# EAGLE schematic omnibus (EAGLE 6.6.0)

## Sheet 1 of 3
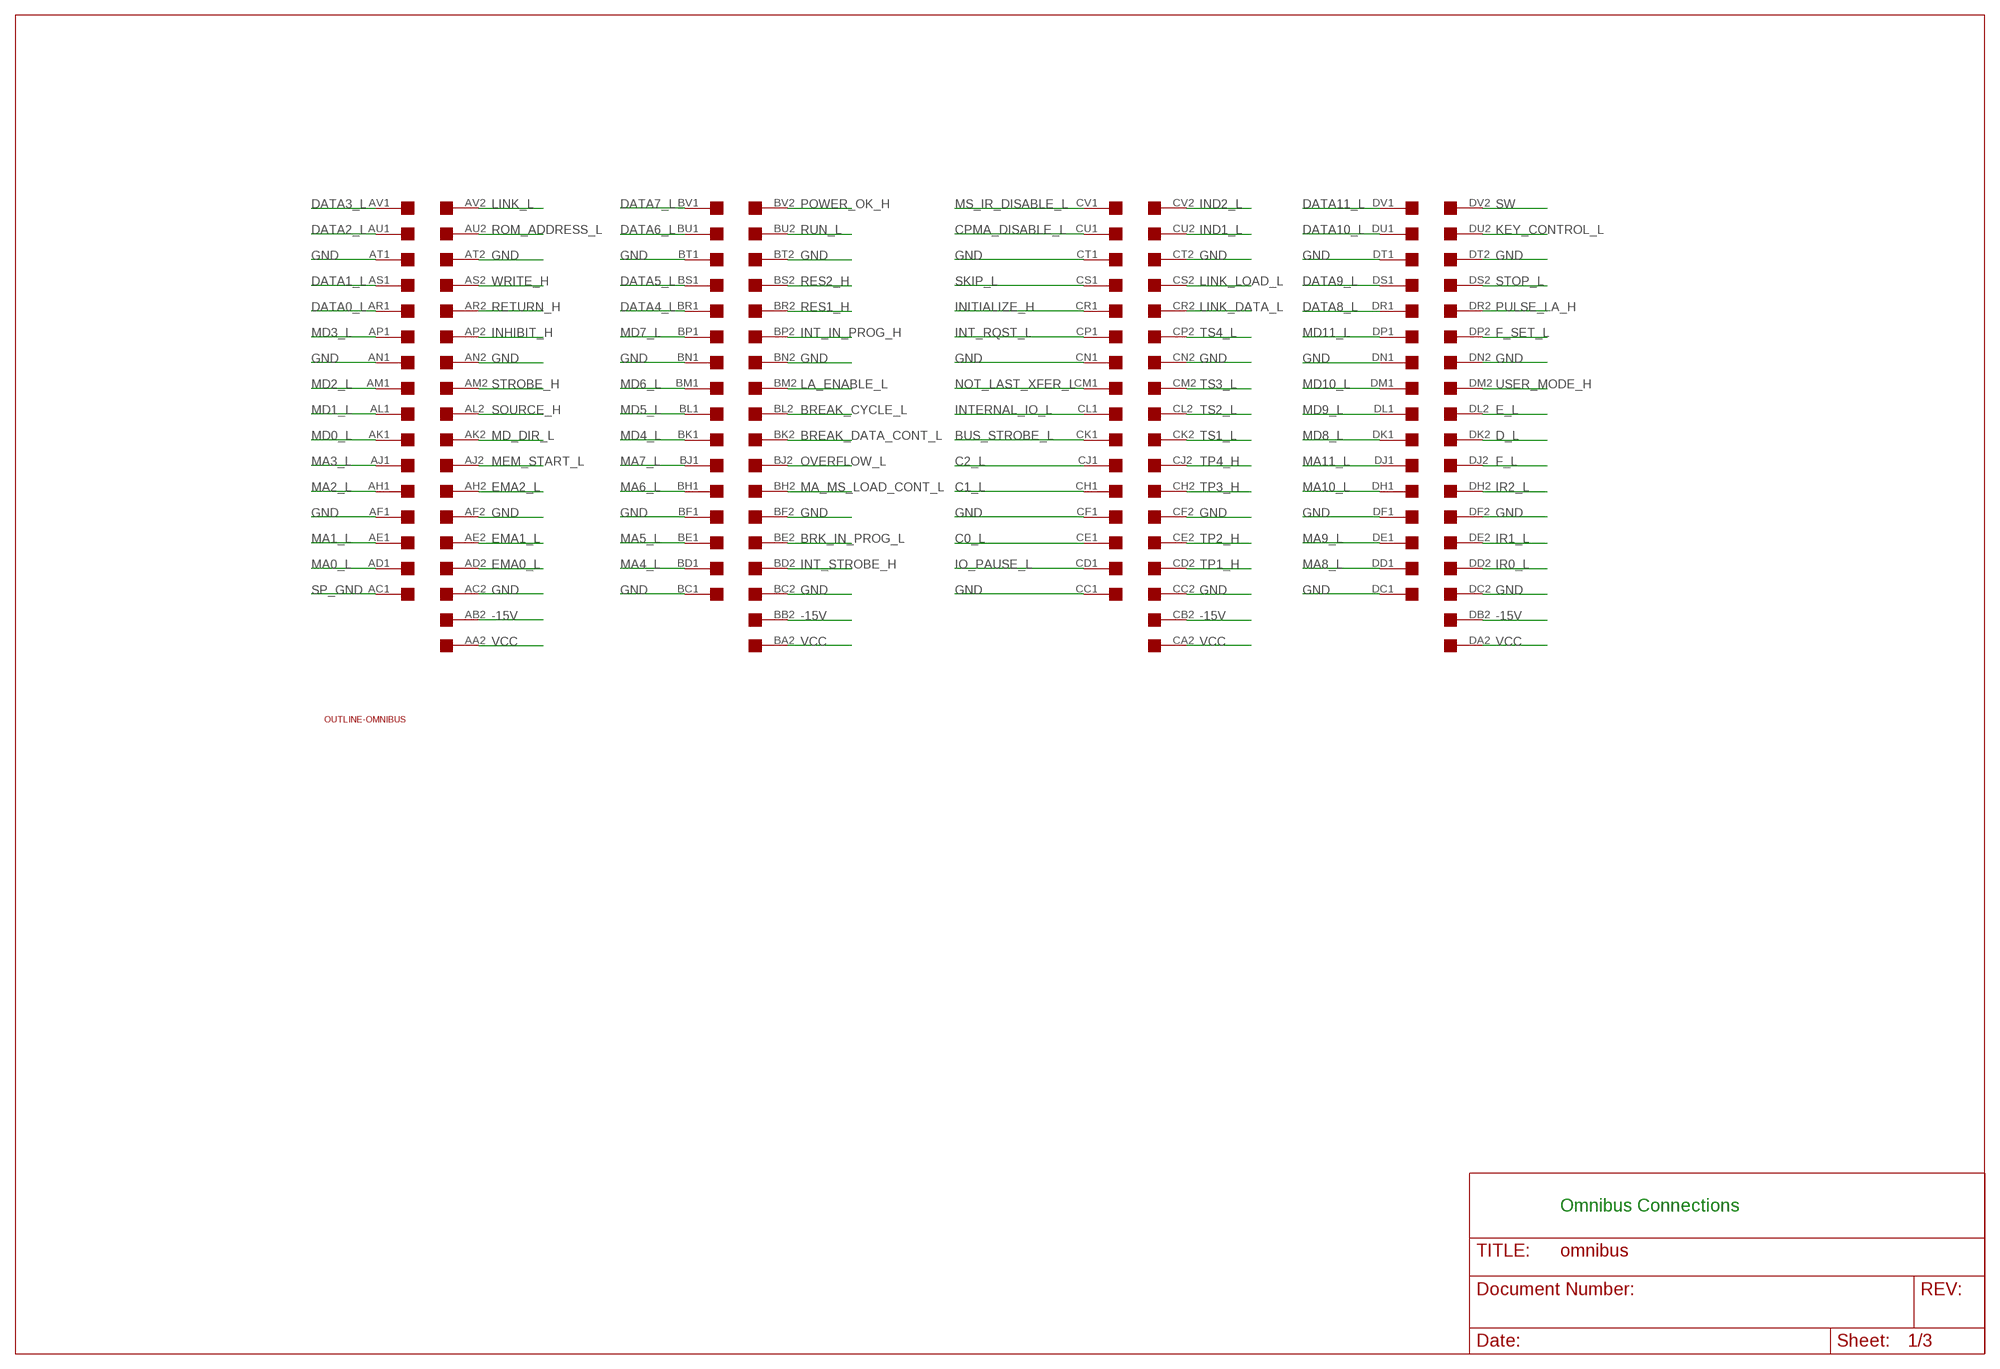
[diagram p0: schematic, sheet 1]

### Parts
U$1  OUTLINE-OMNIBUS  [OMNIBUS]
U$2  QUAD  [EDGE-CON8]

### Nets
-15V: U$2.AB2 U$2.BB2 U$2.CB2 U$2.DB2
BREAK_CYCLE_L: U$2.BL2
BREAK_DATA_CONT_L: U$2.BK2
BRK_IN_PROG_L: U$2.BE2
BUS_STROBE_L: U$2.CK1
C0_L: U$2.CE1 ; also sheet 2
C1_L: U$2.CH1 ; also sheet 2
C2_L: U$2.CJ1
CPMA_DISABLE_L: U$2.CU1
D_L: U$2.DK2
DATA0_L: U$2.AR1 ; also sheet 2
DATA1_L: U$2.AS1 ; also sheet 2
DATA2_L: U$2.AU1 ; also sheet 2
DATA3_L: U$2.AV1 ; also sheet 2
DATA4_L: U$2.BR1 ; also sheet 2
DATA5_L: U$2.BS1 ; also sheet 2
DATA6_L: U$2.BU1 ; also sheet 2
DATA7_L: U$2.BV1 ; also sheet 2
DATA8_L: U$2.DR1 ; also sheet 2
DATA9_L: U$2.DS1 ; also sheet 2
DATA10_L: U$2.DU1 ; also sheet 2
DATA11_L: U$2.DV1 ; also sheet 2
E_L: U$2.DL2
EMA0_L: U$2.AD2 ; also sheet 3
EMA1_L: U$2.AE2 ; also sheet 3
EMA2_L: U$2.AH2 ; also sheet 3
F_L: U$2.DJ2
F_SET_L: U$2.DP2
GND: U$2.AC2 U$2.AF1 U$2.AF2 U$2.AN1 U$2.AN2 U$2.AT1 U$2.AT2 U$2.BC1 U$2.BC2 U$2.BF1 U$2.BF2 U$2.BN1 U$2.BN2 U$2.BT1 U$2.BT2 U$2.CC1 U$2.CC2 U$2.CF1 U$2.CF2 U$2.CN1 U$2.CN2 U$2.CT1 U$2.CT2 U$2.DC1 U$2.DC2 U$2.DF1 U$2.DF2 U$2.DN1 U$2.DN2 U$2.DT1 U$2.DT2 ; also sheet 2,3
IND1_L: U$2.CU2
IND2_L: U$2.CV2
INHIBIT_H: U$2.AP2
INITIALIZE_H: U$2.CR1
INT_IN_PROG_H: U$2.BP2
INT_RQST_L: U$2.CP1 ; also sheet 2
INT_STROBE_H: U$2.BD2
INTERNAL_IO_L: U$2.CL1
IO_PAUSE_L: U$2.CD1 ; also sheet 2
IR0_L: U$2.DD2
IR1_L: U$2.DE2
IR2_L: U$2.DH2
KEY_CONTROL_L: U$2.DU2
LA_ENABLE_L: U$2.BM2
LINK_DATA_L: U$2.CR2
LINK_L: U$2.AV2
LINK_LOAD_L: U$2.CS2
MA0_L: U$2.AD1
MA1_L: U$2.AE1
MA2_L: U$2.AH1
MA3_L: U$2.AJ1
MA4_L: U$2.BD1
MA5_L: U$2.BE1
MA6_L: U$2.BH1
MA7_L: U$2.BJ1
MA8_L: U$2.DD1
MA9_L: U$2.DE1
MA10_L: U$2.DH1
MA11_L: U$2.DJ1
MA_MS_LOAD_CONT_L: U$2.BH2
MD0_L: U$2.AK1 ; also sheet 2
MD1_L: U$2.AL1 ; also sheet 2
MD2_L: U$2.AM1 ; also sheet 2
MD3_L: U$2.AP1 ; also sheet 2
MD4_L: U$2.BK1 ; also sheet 2
MD5_L: U$2.BL1 ; also sheet 2
MD6_L: U$2.BM1 ; also sheet 2
MD7_L: U$2.BP1 ; also sheet 2
MD8_L: U$2.DK1 ; also sheet 2
MD9_L: U$2.DL1 ; also sheet 2
MD10_L: U$2.DM1 ; also sheet 2
MD11_L: U$2.DP1 ; also sheet 2
MD_DIR_L: U$2.AK2
MEM_START_L: U$2.AJ2
MS_IR_DISABLE_L: U$2.CV1
NOT_LAST_XFER_L: U$2.CM1
OVERFLOW_L: U$2.BJ2
POWER_OK_H: U$2.BV2
PULSE_LA_H: U$2.DR2
RES1_H: U$2.BR2
RES2_H: U$2.BS2
RETURN_H: U$2.AR2
ROM_ADDRESS_L: U$2.AU2
RUN_L: U$2.BU2
SKIP_L: U$2.CS1 ; also sheet 2
SOURCE_H: U$2.AL2
SP_GND: U$2.AC1
STOP_L: U$2.DS2
STROBE_H: U$2.AM2
SW: U$2.DV2
TP1_H: U$2.CD2
TP2_H: U$2.CE2
TP3_H: U$2.CH2 ; also sheet 2
TP4_H: U$2.CJ2
TS1_L: U$2.CK2
TS2_L: U$2.CL2
TS3_L: U$2.CM2
TS4_L: U$2.CP2
USER_MODE_H: U$2.DM2
VCC: U$2.AA2 U$2.BA2 U$2.CA2 U$2.DA2 ; also sheet 2,3
WRITE_H: U$2.AS2
Unconnected: U$2.AA1 U$2.AB1 U$2.BA1 U$2.BB1 U$2.CA1 U$2.CB1 U$2.DA1 U$2.DB1

### Notes on the sheet
- Omnibus Connections

## Sheet 2 of 3
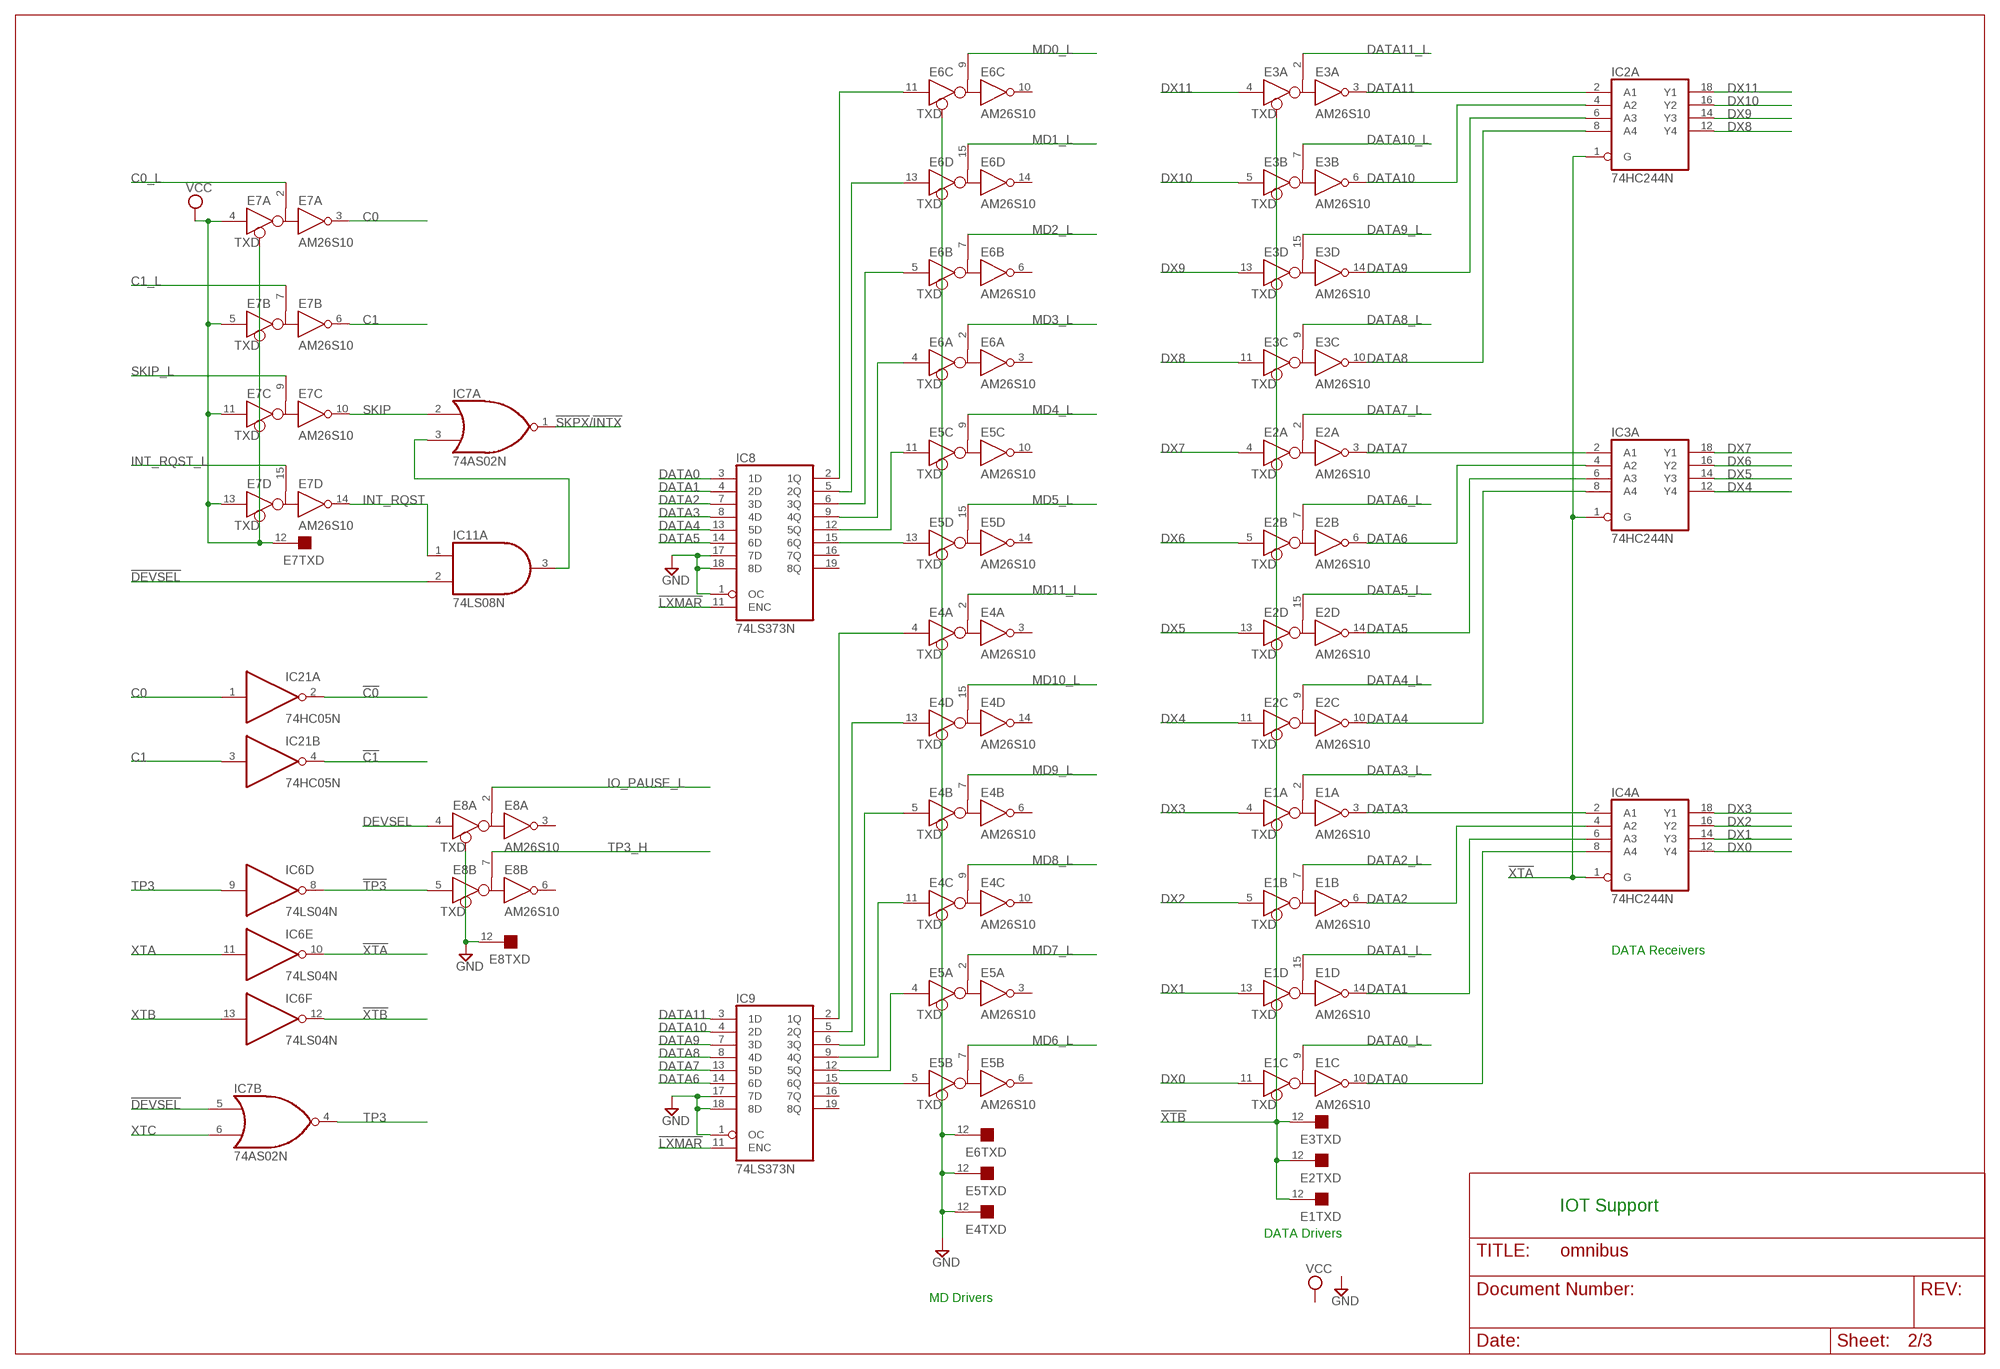
[diagram p1: schematic, sheet 2]

### Parts
E1  AM26S10  [DIL16]
E2  AM26S10  [DIL16]
E3  AM26S10  [DIL16]
E4  AM26S10  [DIL16]
E5  AM26S10  [DIL16]
E6  AM26S10  [DIL16]
E7  AM26S10  [DIL16]
E8  AM26S10  [DIL16]
IC2  74HC244N  74LS244N  [DIL20]
IC3  74HC244N  74LS244N  [DIL20]
IC4  74HC244N  74LS244N  [DIL20]
IC6  74LS04N  [DIL14]
IC7  74AS02N  [DIL14]
IC8  74LS373N  [DIL20]
IC9  74LS373N  [DIL20]
IC11  74LS08N  [DIL14]
IC21  74HC05N  74ALS05N  [DIL14]

### Nets
!C0: IC21.2(A:O) ; also sheet 3
!C1: IC21.4(B:O) ; also sheet 3
!DEVSEL: IC7.5(B:I0) IC11.2(A:I1) ; also sheet 3
!LXMAR: IC8.11(ENC) IC9.11(ENC)
!SKPX!/!INTX: IC7.1(A:O) ; also sheet 3
!TP3: E8.5(B:D) IC6.8(D:O)
!XTA: IC2.1(A:G) IC3.1(A:G) IC4.1(A:G) IC6.10(E:O)
!XTB: E1.12(TXD:TXD) E2.12(TXD:TXD) E3.12(TXD:TXD) IC6.12(F:O)
C0: E7.3(A:R) IC21.1(A:I)
C0_L: E7.2(A:B) ; also sheet 1
C1: E7.6(B:R) IC21.3(B:I)
C1_L: E7.7(B:B) ; also sheet 1
DATA0: E1.10(C:R) IC4.8(A:A4) IC8.3(1D)
DATA0_L: E1.9(C:B) ; also sheet 1
DATA1: E1.14(D:R) IC4.6(A:A3) IC8.4(2D)
DATA1_L: E1.15(D:B) ; also sheet 1
DATA2: E1.6(B:R) IC4.4(A:A2) IC8.7(3D)
DATA2_L: E1.7(B:B) ; also sheet 1
DATA3: E1.3(A:R) IC4.2(A:A1) IC8.8(4D)
DATA3_L: E1.2(A:B) ; also sheet 1
DATA4: E2.10(C:R) IC3.8(A:A4) IC8.13(5D)
DATA4_L: E2.9(C:B) ; also sheet 1
DATA5: E2.14(D:R) IC3.6(A:A3) IC8.14(6D)
DATA5_L: E2.15(D:B) ; also sheet 1
DATA6: E2.6(B:R) IC3.4(A:A2) IC9.14(6D)
DATA6_L: E2.7(B:B) ; also sheet 1
DATA7: E2.3(A:R) IC3.2(A:A1) IC9.13(5D)
DATA7_L: E2.2(A:B) ; also sheet 1
DATA8: E3.10(C:R) IC2.8(A:A4) IC9.8(4D)
DATA8_L: E3.9(C:B) ; also sheet 1
DATA9: E3.14(D:R) IC2.6(A:A3) IC9.7(3D)
DATA9_L: E3.15(D:B) ; also sheet 1
DATA10: E3.6(B:R) IC2.4(A:A2) IC9.4(2D)
DATA10_L: E3.7(B:B) ; also sheet 1
DATA11: E3.3(A:R) IC2.2(A:A1) IC9.3(1D)
DATA11_L: E3.2(A:B) ; also sheet 1
DEVSEL: E8.4(A:D) ; also sheet 3
DX0: E1.11(C:D) IC4.12(A:Y4) ; also sheet 3
DX1: E1.13(D:D) IC4.14(A:Y3) ; also sheet 3
DX2: E1.5(B:D) IC4.16(A:Y2) ; also sheet 3
DX3: E1.4(A:D) IC4.18(A:Y1) ; also sheet 3
DX4: E2.11(C:D) IC3.12(A:Y4) ; also sheet 3
DX5: E2.13(D:D) IC3.14(A:Y3) ; also sheet 3
DX6: E2.5(B:D) IC3.16(A:Y2) ; also sheet 3
DX7: E2.4(A:D) IC3.18(A:Y1) ; also sheet 3
DX8: E3.11(C:D) IC2.12(A:Y4) ; also sheet 3
DX9: E3.13(D:D) IC2.14(A:Y3) ; also sheet 3
DX10: E3.5(B:D) IC2.16(A:Y2) ; also sheet 3
DX11: E3.4(A:D) IC2.18(A:Y1) ; also sheet 3
GND: E4.12(TXD:TXD) E5.12(TXD:TXD) E6.12(TXD:TXD) E8.12(TXD:TXD) IC8.1(OC) IC8.17(7D) IC8.18(8D) IC9.1(OC) IC9.17(7D) IC9.18(8D) ; also sheet 1,3
INT_RQST: E7.14(D:R) IC11.1(A:I0)
INT_RQST_L: E7.15(D:B) ; also sheet 1
IO_PAUSE_L: E8.2(A:B) ; also sheet 1
MD0_L: E6.9(C:B) ; also sheet 1
MD1_L: E6.15(D:B) ; also sheet 1
MD2_L: E6.7(B:B) ; also sheet 1
MD3_L: E6.2(A:B) ; also sheet 1
MD4_L: E5.9(C:B) ; also sheet 1
MD5_L: E5.15(D:B) ; also sheet 1
MD6_L: E5.7(B:B) ; also sheet 1
MD7_L: E5.2(A:B) ; also sheet 1
MD8_L: E4.9(C:B) ; also sheet 1
MD9_L: E4.7(B:B) ; also sheet 1
MD10_L: E4.15(D:B) ; also sheet 1
MD11_L: E4.2(A:B) ; also sheet 1
N$2: IC7.3(A:I1) IC11.3(A:O)
N$3: E6.11(C:D) IC8.2(1Q)
N$4: E6.13(D:D) IC8.5(2Q)
N$5: E6.5(B:D) IC8.6(3Q)
N$6: E6.4(A:D) IC8.9(4Q)
N$7: E5.11(C:D) IC8.12(5Q)
N$8: E5.13(D:D) IC8.15(6Q)
N$9: E5.5(B:D) IC9.15(6Q)
N$10: E5.4(A:D) IC9.12(5Q)
N$11: E4.11(C:D) IC9.9(4Q)
N$12: E4.5(B:D) IC9.6(3Q)
N$14: E4.13(D:D) IC9.5(2Q)
N$15: E4.4(A:D) IC9.2(1Q)
SKIP: E7.10(C:R) IC7.2(A:I0)
SKIP_L: E7.9(C:B) ; also sheet 1
TP3: IC6.9(D:I) IC7.4(B:O)
TP3_H: E8.7(B:B) ; also sheet 1
VCC: E7.4(A:D) E7.5(B:D) E7.11(C:D) E7.12(TXD:TXD) E7.13(D:D) ; also sheet 1,3
XTA: IC6.11(E:I) ; also sheet 3
XTB: IC6.13(F:I) ; also sheet 3
XTC: IC7.6(B:I1) ; also sheet 3
Unconnected: E4.3(A:R) E4.6(B:R) E4.10(C:R) E4.14(D:R) E5.3(A:R) E5.6(B:R) E5.10(C:R) E5.14(D:R) E6.3(A:R) E6.6(B:R) E6.10(C:R) E6.14(D:R) E8.3(A:R) E8.6(B:R) E8.9(C:B) E8.10(C:R) E8.11(C:D) E8.13(D:D) E8.14(D:R) E8.15(D:B) IC2.3(B:Y4) IC2.5(B:Y3) IC2.7(B:Y2) IC2.9(B:Y1) IC2.11(B:A1) IC2.13(B:A2) IC2.15(B:A3) IC2.17(B:A4) IC2.19(B:G) IC3.3(B:Y4) IC3.5(B:Y3) IC3.7(B:Y2) IC3.9(B:Y1) IC3.11(B:A1) IC3.13(B:A2) IC3.15(B:A3) IC3.17(B:A4) IC3.19(B:G) IC4.3(B:Y4) IC4.5(B:Y3) IC4.7(B:Y2) IC4.9(B:Y1) IC4.11(B:A1) IC4.13(B:A2) IC4.15(B:A3) IC4.17(B:A4) IC4.19(B:G) IC6.3(B:I) IC6.4(B:O) IC6.5(C:I) IC6.6(C:O) IC8.16(7Q) IC8.19(8Q) IC9.16(7Q) IC9.19(8Q) IC21.8(D:O) IC21.9(D:I) IC21.10(E:O) IC21.11(E:I) IC21.12(F:O) IC21.13(F:I)

### Notes on the sheet
- DATA Receivers
- IOT Support
- DATA Drivers
- MD Drivers

## Sheet 3 of 3
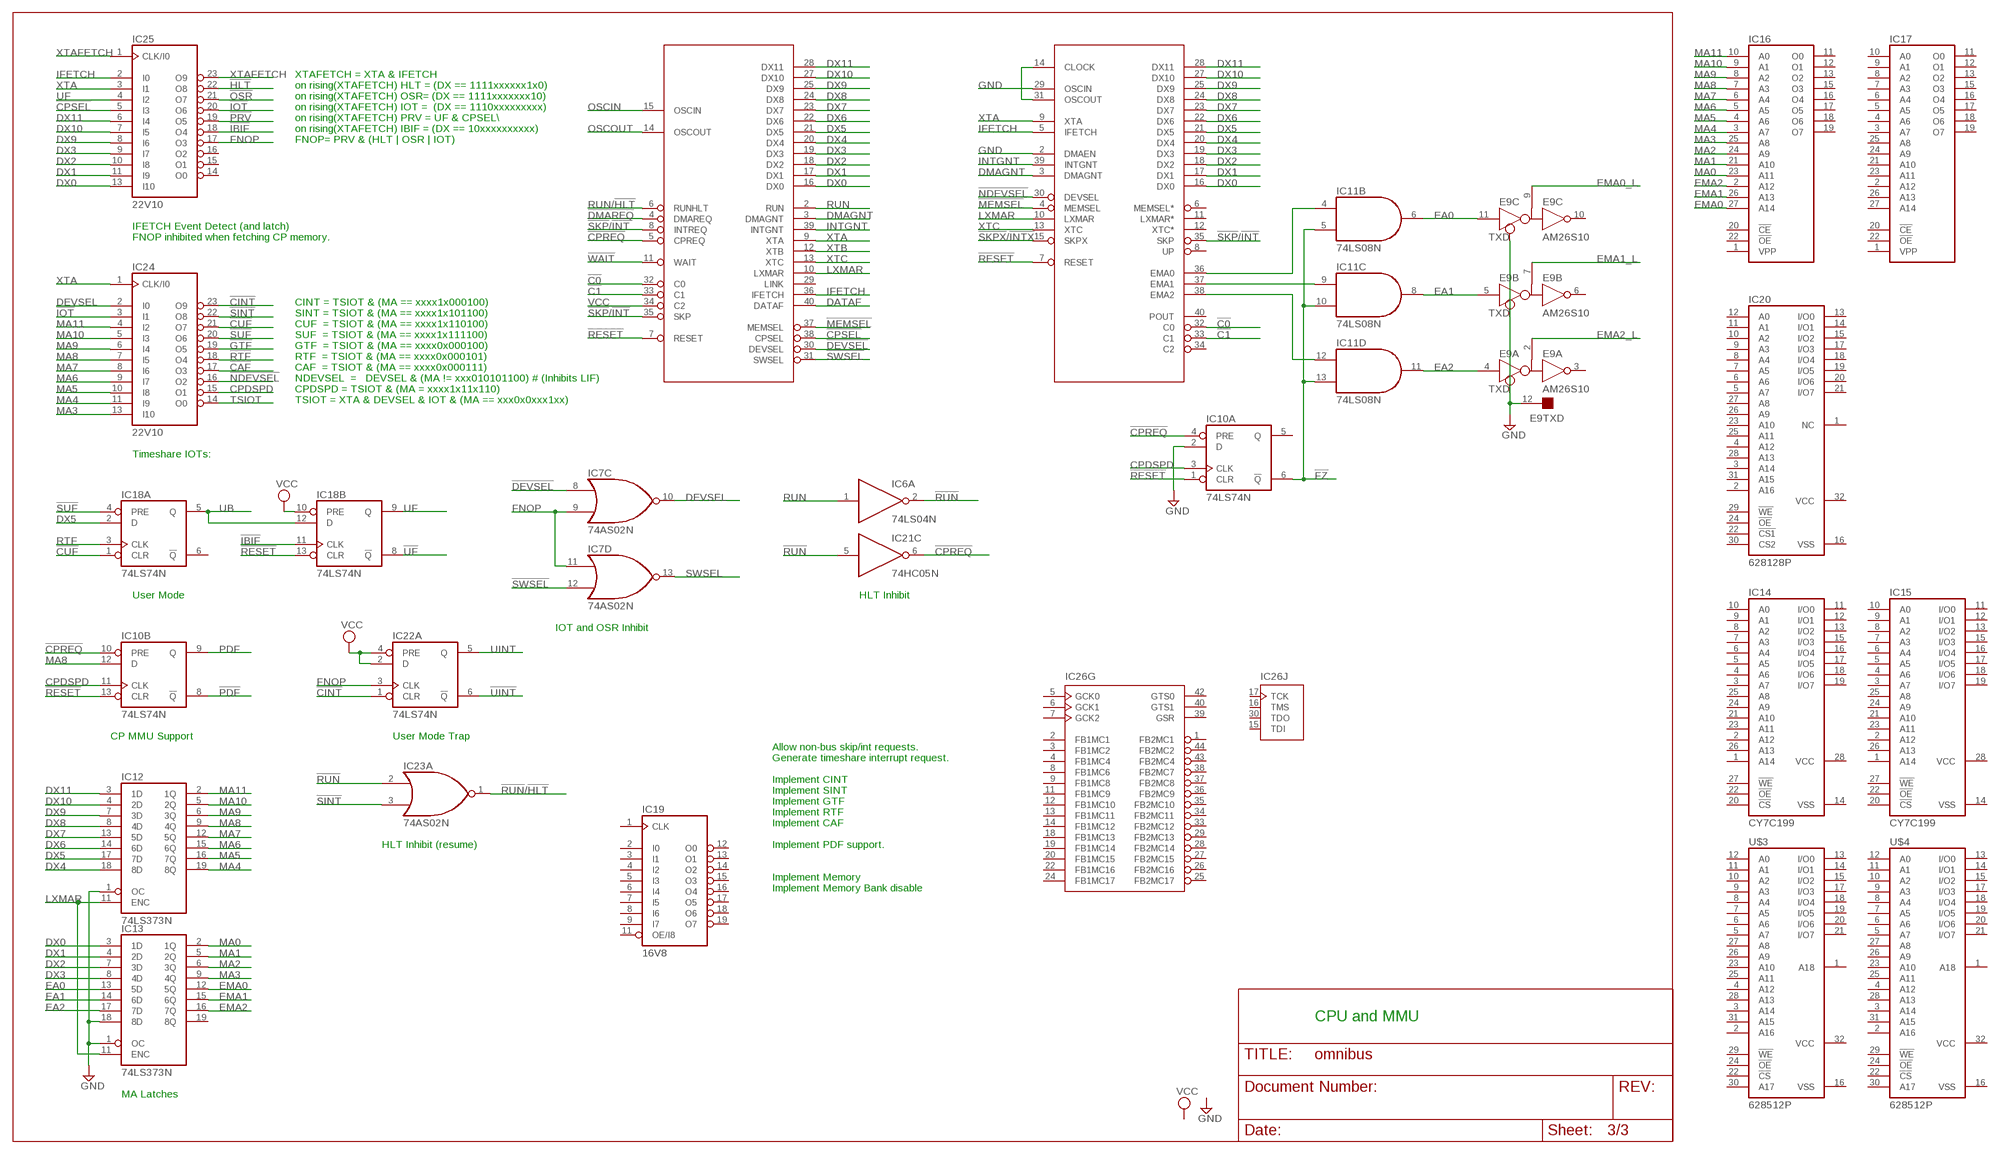
[diagram p2: schematic, sheet 3]

### Parts
E9  AM26S10  [DIL16]
IC1  IM6100  [DIL40]
IC5  IM6102  [DIL40]
IC10  74LS74N  [DIL14]
IC12  74LS373N  [DIL20]
IC13  74LS373N  [DIL20]
IC14  CY7C199  62832P  [DIL28-3]
IC15  CY7C199  62832P  [DIL28-3]
IC16  27256  [DIL28]
IC17  27256  [DIL28]
IC18  74LS74N  [DIL14]
IC19  16V8  [DIL20]
IC20  628128P  [DIL32]
IC22  74LS74N  [DIL14]
IC23  74AS02N  [DIL14]
IC24  22V10  [DIL24-3]
IC25  22V10  [DIL24-3]
IC26  XC9536-44  [PLCC-S44]
U$3  628512P  [DIL32]
U$4  628512P  [DIL32]

### Nets
!C0: IC1.32(C0) IC5.32(C0) ; also sheet 2
!C1: IC1.33(C1) IC5.33(C1) ; also sheet 2
!CAF: IC24.17(O3)
!CINT: IC22.1(A:CLR) IC24.23(O9)
!CPREQ: IC1.5(CPREQ) IC10.4(A:PRE) IC10.10(B:PRE) IC21.6(C:O)
!CPSEL: IC1.38(CPSEL) IC25.5(I3)
!CUF: IC18.1(A:CLR) IC24.21(O7)
!DEVSEL: IC1.30(DEVSEL) IC7.8(C:I0) ; also sheet 2
!DMAREQ: IC1.4(DMAREQ)
!FZ: IC10.6(A:!Q) IC11.5(B:I1) IC11.10(C:I1) IC11.13(D:I1)
!GTF: IC24.19(O5)
!HLT: IC25.22(O8)
!IBIF: IC18.11(B:CLK) IC25.18(O4)
!IOT: IC24.3(I1) IC25.20(O6)
!MEMSEL: IC1.37(MEMSEL) IC5.4(MEMSEL)
!NDEVSEL: IC5.30(DEVSEL) IC24.16(O2)
!OSR: IC25.21(O7)
!PDF: IC10.8(B:!Q)
!PRV: IC25.19(O5)
!RESET: IC1.7(RESET) IC5.7(RESET) IC10.1(A:CLR) IC10.13(B:CLR) IC18.13(B:CLR)
!RTF: IC24.18(O4)
!RUN: IC6.2(A:O) IC21.5(C:I) IC23.2(A:I0)
!RUN!/!HLT: IC23.1(A:O)
!SINT: IC23.3(A:I1) IC24.22(O8)
!SKP!/!INT: IC1.8(INTREQ) IC1.35(SKP) IC5.35(SKP)
!SKPX!/!INTX: IC5.15(SKPX) ; also sheet 2
!SUF: IC18.4(A:PRE) IC24.20(O6)
!SWSEL: IC1.31(SWSEL) IC7.12(D:I1)
!UF: IC18.8(B:!Q)
!UINT: IC22.6(A:!Q)
!WAIT: IC1.11(WAIT)
CPDSPD: IC10.3(A:CLK) IC10.11(B:CLK) IC24.15(O1)
DATAF: IC1.40(DATAF)
DEVSEL: IC7.10(C:O) IC24.2(I0) ; also sheet 2
DMAGNT: IC1.3(DMAGNT) IC5.3(DMAGNT)
DX0: IC1.16(DX0) IC5.16(DX0) IC13.3(1D) IC25.13(I10) ; also sheet 2
DX1: IC1.17(DX1) IC5.17(DX1) IC13.4(2D) IC25.11(I9) ; also sheet 2
DX2: IC1.18(DX2) IC5.18(DX2) IC13.7(3D) IC25.10(I8) ; also sheet 2
DX3: IC1.19(DX3) IC5.19(DX3) IC13.8(4D) IC25.9(I7) ; also sheet 2
DX4: IC1.20(DX4) IC5.20(DX4) IC12.18(8D) ; also sheet 2
DX5: IC1.21(DX5) IC5.21(DX5) IC12.17(7D) IC18.2(A:D) ; also sheet 2
DX6: IC1.22(DX6) IC5.22(DX6) IC12.14(6D) ; also sheet 2
DX7: IC1.23(DX7) IC5.23(DX7) IC12.13(5D) ; also sheet 2
DX8: IC1.24(DX8) IC5.24(DX8) IC12.8(4D) ; also sheet 2
DX9: IC1.25(DX9) IC5.25(DX9) IC12.7(3D) IC25.8(I6) ; also sheet 2
DX10: IC1.27(DX10) IC5.27(DX10) IC12.4(2D) IC25.7(I5) ; also sheet 2
DX11: IC1.28(DX11) IC5.28(DX11) IC12.3(1D) IC25.6(I4) ; also sheet 2
EA0: E9.11(C:D) IC11.6(B:O) IC13.13(5D)
EA1: E9.5(B:D) IC11.8(C:O) IC13.14(6D)
EA2: E9.4(A:D) IC11.11(D:O) IC13.17(7D)
EMA0: IC13.12(5Q) IC16.27(A14)
EMA0_L: E9.9(C:B) ; also sheet 1
EMA1: IC13.15(6Q) IC16.26(A13)
EMA1_L: E9.7(B:B) ; also sheet 1
EMA2: IC13.16(7Q) IC16.2(A12)
EMA2_L: E9.2(A:B) ; also sheet 1
FNOP: IC7.9(C:I1) IC7.11(D:I0) IC22.3(A:CLK) IC25.17(O3)
GND: E9.12(TXD:TXD) IC5.2(DMAEN) IC5.29(OSCIN) IC10.2(A:D) IC12.1(OC) IC13.1(OC) IC13.18(8D) ; also sheet 1,2
IFETCH: IC1.36(IFETCH) IC5.5(IFETCH) IC25.2(I0)
INTGNT: IC1.39(INTGNT) IC5.39(INTGNT)
LXMAR: IC1.10(LXMAR) IC5.10(LXMAR) IC12.11(ENC) IC13.11(ENC)
MA0: IC13.2(1Q) IC16.23(A11)
MA1: IC13.5(2Q) IC16.21(A10)
MA2: IC13.6(3Q) IC16.24(A9)
MA3: IC13.9(4Q) IC16.25(A8) IC24.13(I10)
MA4: IC12.19(8Q) IC16.3(A7) IC24.11(I9)
MA5: IC12.16(7Q) IC16.4(A6) IC24.10(I8)
MA6: IC12.15(6Q) IC16.5(A5) IC24.9(I7)
MA7: IC12.12(5Q) IC16.6(A4) IC24.8(I6)
MA8: IC10.12(B:D) IC12.9(4Q) IC16.7(A3) IC24.7(I5)
MA9: IC12.6(3Q) IC16.8(A2) IC24.6(I4)
MA10: IC12.5(2Q) IC16.9(A1) IC24.5(I3)
MA11: IC12.2(1Q) IC16.10(A0) IC24.4(I2)
N$1: IC5.14(CLOCK) IC5.31(OSCOUT)
N$16: IC5.37(EMA1) IC11.9(C:I0)
N$17: IC5.36(EMA0) IC11.4(B:I0)
N$18: IC5.38(EMA2) IC11.12(D:I0)
OSCIN: IC1.15(OSCIN)
OSCOUT: IC1.14(OSCOUT)
PDF: IC10.9(B:Q)
RTF: IC18.3(A:CLK)
RUN: IC1.2(RUN) IC6.1(A:I)
RUN/!HLT: IC1.6(RUNHLT)
SWSEL: IC7.13(D:O)
TSIOT: IC24.14(O0)
UB: IC18.5(A:Q) IC18.12(B:D)
UF: IC18.9(B:Q) IC25.4(I2)
UINT: IC22.5(A:Q)
VCC: IC1.34(C2) IC18.10(B:PRE) IC22.2(A:D) IC22.4(A:PRE) ; also sheet 1,2
XTA: IC1.9(XTA) IC5.9(XTA) IC24.1(CLK/I0) IC25.3(I1) ; also sheet 2
XTAFETCH: IC25.1(CLK/I0) IC25.23(O9)
XTB: IC1.12(XTB) ; also sheet 2
XTC: IC1.13(XTC) IC5.13(XTC) ; also sheet 2
Unconnected: E9.3(A:R) E9.6(B:R) E9.10(C:R) E9.13(D:D) E9.14(D:R) E9.15(D:B) IC1.29(LINK) IC5.6(MEMSEL*) IC5.8(UP) IC5.11(LXMAR*) IC5.12(XTC*) IC5.34(C2) IC5.40(POUT) IC10.5(A:Q) IC13.19(8Q) IC14.1(A14) IC14.2(A12) IC14.3(A7) IC14.4(A6) IC14.5(A5) IC14.6(A4) IC14.7(A3) IC14.8(A2) IC14.9(A1) IC14.10(A0) IC14.11(I/O0) IC14.12(I/O1) IC14.13(I/O2) IC14.15(I/O3) IC14.16(I/O4) IC14.17(I/O5) IC14.18(I/O6) IC14.19(I/O7) IC14.20(!CS) IC14.21(A10) IC14.22(!OE) IC14.23(A11) IC14.24(A9) IC14.25(A8) IC14.26(A13) IC14.27(!WE) IC15.1(A14) IC15.2(A12) IC15.3(A7) IC15.4(A6) IC15.5(A5) IC15.6(A4) IC15.7(A3) IC15.8(A2) IC15.9(A1) IC15.10(A0) IC15.11(I/O0) IC15.12(I/O1) IC15.13(I/O2) IC15.15(I/O3) IC15.16(I/O4) IC15.17(I/O5) IC15.18(I/O6) IC15.19(I/O7) IC15.20(!CS) IC15.21(A10) IC15.22(!OE) IC15.23(A11) IC15.24(A9) IC15.25(A8) IC15.26(A13) IC15.27(!WE) IC16.1(VPP) IC16.11(O0) IC16.12(O1) IC16.13(O2) IC16.15(O3) IC16.16(O4) IC16.17(O5) IC16.18(O6) IC16.19(O7) IC16.20(!CE) IC16.22(!OE) IC17.1(VPP) IC17.2(A12) IC17.3(A7) IC17.4(A6) IC17.5(A5) IC17.6(A4) IC17.7(A3) IC17.8(A2) IC17.9(A1) IC17.10(A0) IC17.11(O0) IC17.12(O1) IC17.13(O2) IC17.15(O3) IC17.16(O4) IC17.17(O5) IC17.18(O6) IC17.19(O7) IC17.20(!CE) IC17.21(A10) IC17.22(!OE) IC17.23(A11) IC17.24(A9) IC17.25(A8) IC17.26(A13) IC17.27(A14) IC18.6(A:!Q) IC19.1(CLK) IC19.2(I0) IC19.3(I1) IC19.4(I2) IC19.5(I3) IC19.6(I4) IC19.7(I5) IC19.8(I6) IC19.9(I7) IC19.11(OE/I8) IC19.12(O0) IC19.13(O1) IC19.14(O2) IC19.15(O3) IC19.16(O4) IC19.17(O5) IC19.18(O6) IC19.19(O7) IC20.1(NC) IC20.2(A16) IC20.3(A14) IC20.4(A12) IC20.5(A7) IC20.6(A6) IC20.7(A5) IC20.8(A4) IC20.9(A3) IC20.10(A2) IC20.11(A1) IC20.12(A0) IC20.13(I/O0) IC20.14(I/O1) IC20.15(I/O2) IC20.17(I/O3) IC20.18(I/O4) IC20.19(I/O5) IC20.20(I/O6) IC20.21(I/O7) IC20.22(!CS1) IC20.23(A10) IC20.24(!OE) IC20.25(A11) IC20.26(A9) IC20.27(A8) IC20.28(A13) IC20.29(!WE) IC20.30(CS2) IC20.31(A15) IC22.8(B:!Q) IC22.9(B:Q) IC22.10(B:PRE) IC22.11(B:CLK) IC22.12(B:D) IC22.13(B:CLR) IC23.4(B:O) IC23.5(B:I0) IC23.6(B:I1) IC23.8(C:I0) IC23.9(C:I1) IC23.10(C:O) IC23.11(D:I0) IC23.12(D:I1) IC23.13(D:O) IC25.14(O0) IC25.15(O1) IC25.16(O2) IC26.1(G:FB2MC1) IC26.2(G:FB1MC1) IC26.3(G:FB1MC2) IC26.4(G:FB1MC4) IC26.5(G:GCK0) IC26.6(G:GCK1) IC26.7(G:GCK2) IC26.8(G:FB1MC6) IC26.9(G:FB1MC8) IC26.11(G:FB1MC9) IC26.12(G:FB1MC10) IC26.13(G:FB1MC11) IC26.14(G:FB1MC12) IC26.15(J:TDI) IC26.16(J:TMS) IC26.17(J:TCK) IC26.18(G:FB1MC13) IC26.19(G:FB1MC14) IC26.20(G:FB1MC15) IC26.22(G:FB1MC16) IC26.24(G:FB1MC17) IC26.25(G:FB2MC17) IC26.26(G:FB2MC16) IC26.27(G:FB2MC15) IC26.28(G:FB2MC14) IC26.29(G:FB2MC13) IC26.30(J:TDO) IC26.33(G:FB2MC12) IC26.34(G:FB2MC11) IC26.35(G:FB2MC10) IC26.36(G:FB2MC9) IC26.37(G:FB2MC8) IC26.38(G:FB2MC7) IC26.39(G:GSR) IC26.40(G:GTS1) IC26.42(G:GTS0) IC26.43(G:FB2MC4) IC26.44(G:FB2MC2) U$3.1(A18) U$3.2(A16) U$3.3(A14) U$3.4(A12) U$3.5(A7) U$3.6(A6) U$3.7(A5) U$3.8(A4) U$3.9(A3) U$3.10(A2) U$3.11(A1) U$3.12(A0) U$3.13(I/O0) U$3.14(I/O1) U$3.15(I/O2) U$3.17(I/O3) U$3.18(I/O4) U$3.19(I/O5) U$3.20(I/O6) U$3.21(I/O7) U$3.22(!CS) U$3.23(A10) U$3.24(!OE) U$3.25(A11) U$3.26(A9) U$3.27(A8) U$3.28(A13) U$3.29(!WE) U$3.30(A17) U$3.31(A15) U$4.1(A18) U$4.2(A16) U$4.3(A14) U$4.4(A12) U$4.5(A7) U$4.6(A6) U$4.7(A5) U$4.8(A4) U$4.9(A3) U$4.10(A2) U$4.11(A1) U$4.12(A0) U$4.13(I/O0) U$4.14(I/O1) U$4.15(I/O2) U$4.17(I/O3) U$4.18(I/O4) U$4.19(I/O5) U$4.20(I/O6) U$4.21(I/O7) U$4.22(!CS) U$4.23(A10) U$4.24(!OE) U$4.25(A11) U$4.26(A9) U$4.27(A8) U$4.28(A13) U$4.29(!WE) U$4.30(A17) U$4.31(A15)

### Notes on the sheet
- XTAFETCH = XTA & IFETCH
- on rising(XTAFETCH) HLT = (DX == 1111xxxxxx1x0)
- on rising(XTAFETCH) OSR= (DX == 1111xxxxxxx10)
- on rising(XTAFETCH) IOT =  (DX == 1110xxxxxxxxx)
- on rising(XTAFETCH) PRV = UF & CPSEL\\
- on rising(XTAFETCH) IBIF = (DX == 10xxxxxxxxxx)
- FNOP= PRV & (HLT | OSR | IOT)
- IFETCH Event Detect (and latch)
- FNOP inhibited when fetching CP memory.
- CINT = TSIOT & (MA == xxxx1x000100)
- SINT = TSIOT & (MA == xxxx1x101100)
- CUF  = TSIOT & (MA == xxxx1x110100)
- SUF  = TSIOT & (MA == xxxx1x111100)
- GTF  = TSIOT & (MA == xxxx0x000100)
- RTF  = TSIOT & (MA == xxxx0x000101)
- CAF  = TSIOT & (MA == xxxx0x000111)
- NDEVSEL  =   DEVSEL & (MA \!= xxx010101100) # (Inhibits LIF)
- CPDSPD = TSIOT & (MA = xxxx1x11x110)
- TSIOT = XTA & DEVSEL & IOT & (MA == xxx0x0xxx1xx)
- Timeshare IOTs:
- User Mode | HLT Inhibit
- IOT and OSR Inhibit
- CP MMU Support | User Mode Trap
- Allow non-bus skip/int requests.
- Generate timeshare interrupt request.
- Implement CINT
- Implement SINT
- Implement GTF
- Implement RTF
- Implement CAF
- HLT Inhibit (resume) | Implement PDF support.
- Implement Memory
- Implement Memory Bank disable
- CPU and MMU
- MA Latches

## Power pins joined to a net without a drawn wire
GND: E1.1(GND:GND) E1.8(PWR:GND) E2.1(GND:GND) E2.8(PWR:GND) E3.1(GND:GND) E3.8(PWR:GND) E4.1(GND:GND) E4.8(PWR:GND) E5.1(GND:GND) E5.8(PWR:GND) E6.1(GND:GND) E6.8(PWR:GND) E7.1(GND:GND) E7.8(PWR:GND) E8.1(GND:GND) E8.8(PWR:GND) E9.1(GND:GND) E9.8(PWR:GND) IC1.26(GND) IC2.10(P:GND) IC3.10(P:GND) IC4.10(P:GND) IC5.26(GND) IC6.7(P:GND) IC7.7(P:GND) IC8.10(GND) IC9.10(GND) IC10.7(P:GND) IC11.7(P:GND) IC12.10(GND) IC13.10(GND) IC16.14(GND) IC17.14(GND) IC18.7(P:GND) IC19.10(GND) IC21.7(P:GND) IC22.7(P:GND) IC23.7(P:GND) IC24.12(GND) IC25.12(GND) IC26.10(P:GND) IC26.23(P:GND) IC26.31(P:GND)
VCC: E1.16(PWR:VCC) E2.16(PWR:VCC) E3.16(PWR:VCC) E4.16(PWR:VCC) E5.16(PWR:VCC) E6.16(PWR:VCC) E7.16(PWR:VCC) E8.16(PWR:VCC) E9.16(PWR:VCC) IC1.1(VCC) IC2.20(P:VCC) IC3.20(P:VCC) IC4.20(P:VCC) IC5.1(VCC) IC6.14(P:VCC) IC7.14(P:VCC) IC8.20(VCC) IC9.20(VCC) IC10.14(P:VCC) IC11.14(P:VCC) IC12.20(VCC) IC13.20(VCC) IC14.28(VCC) IC15.28(VCC) IC16.28(VCC) IC17.28(VCC) IC18.14(P:VCC) IC19.20(VCC) IC20.32(VCC) IC21.14(P:VCC) IC22.14(P:VCC) IC23.14(P:VCC) IC24.24(VCC) IC25.24(VCC) IC26.21(P:VCC) IC26.32(P:VCC) IC26.41(P:VCC) U$3.32(VCC) U$4.32(VCC)
VSS: IC14.14(VSS) IC15.14(VSS) IC20.16(VSS) U$3.16(VSS) U$4.16(VSS)

## Library data of the parts
E1-E9 = dec-con:AM26S10: Bus Transceiver
IC1 = dec-con:IM6100: IM6100 PDP-8 on a chip.
IC2-IC4 = 74xx-us:74*244: Octal BUFFER and LINE DRIVER, 3-state
IC5 = dec-con:IM6102: MEDIC MMU/DMA/RTC for IM6100.
IC6 = 74xx-us:74*04: Hex INVERTER
IC7 IC23 = 74xx-us:74*02: Quad 2-input NOR gate
IC8 IC9 IC12 IC13 = 74xx-us:74*373: Octal D type transparent LATCH, edge triggered
IC10 IC18 IC22 = 74xx-us:74*74: Dual D type positive edge triggered FLIP FLOP, preset and clear
IC11 = 74xx-us:74*08: Quad 2-input AND gate
IC14 IC15 = memory-hitachi:62832P: MEMORY; OC_FARNELL: unknown; OC_NEWARK: unknown
IC16 IC17 = memory:27256: MEMORY
IC19 = pal:16V8: PAL; MPN: GAL16V8D-7LPN; OC_FARNELL: 9699740; OC_NEWARK: 97K0449
IC20 = memory-hitachi:628128P: MEMORY; OC_FARNELL: unknown; OC_NEWARK: unknown
IC21 = 74xx-us:74*05: Hex INVERTER, open collector
IC24 IC25 = pal:22V10: PAL; MPN: GAL22V10D-7LPN; OC_FARNELL: 1571925; OC_NEWARK: 97M0480
IC26 = XILINX:XC9536-44
U$1 = dec-con:OUTLINE-*: Board outlines for DEC boards.
U$2 = dec-con:QUAD: Quad-Height DEC board
U$3 U$4 = dec-con:628512P: 512Kx8 Static RAM